# EAGLE design AD2 Breadboard Breakout v0.1 (EAGLE 9.6.2)
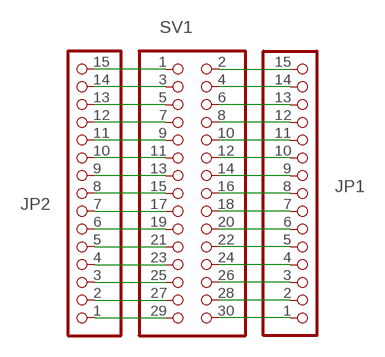
[diagram p0: schematic, sheet 1]

## Parts
JP1  PINHD-1X15-CB  [1X15-CB]
JP2  PINHD-1X15-CB  [1X15-CB]
SV1  PINHD-2X15  [2X15]

## Nets
N$1: JP2.15 SV1.1
N$2: JP1.15 SV1.2
N$3: JP2.14 SV1.3
N$4: JP1.14 SV1.4
N$5: JP2.13 SV1.5
N$6: JP1.13 SV1.6
N$7: JP2.12 SV1.7
N$8: JP1.12 SV1.8
N$9: JP2.11 SV1.9
N$10: JP1.11 SV1.10
N$11: JP2.10 SV1.11
N$12: JP1.10 SV1.12
N$13: JP2.9 SV1.13
N$14: JP1.9 SV1.14
N$15: JP2.8 SV1.15
N$16: JP1.8 SV1.16
N$17: JP2.7 SV1.17
N$18: JP1.7 SV1.18
N$19: JP2.6 SV1.19
N$20: JP1.6 SV1.20
N$21: JP2.5 SV1.21
N$22: JP1.5 SV1.22
N$23: JP2.4 SV1.23
N$24: JP1.4 SV1.24
N$25: JP2.3 SV1.25
N$26: JP1.3 SV1.26
N$27: JP2.2 SV1.27
N$28: JP1.2 SV1.28
N$29: JP2.1 SV1.29
N$30: JP1.1 SV1.30

## Library data of the parts
JP1 JP2 = Adafruit3.0:PINHD-1X15: PIN HEADER
SV1 = pinhead:PINHD-2X15: PIN HEADER

## Board
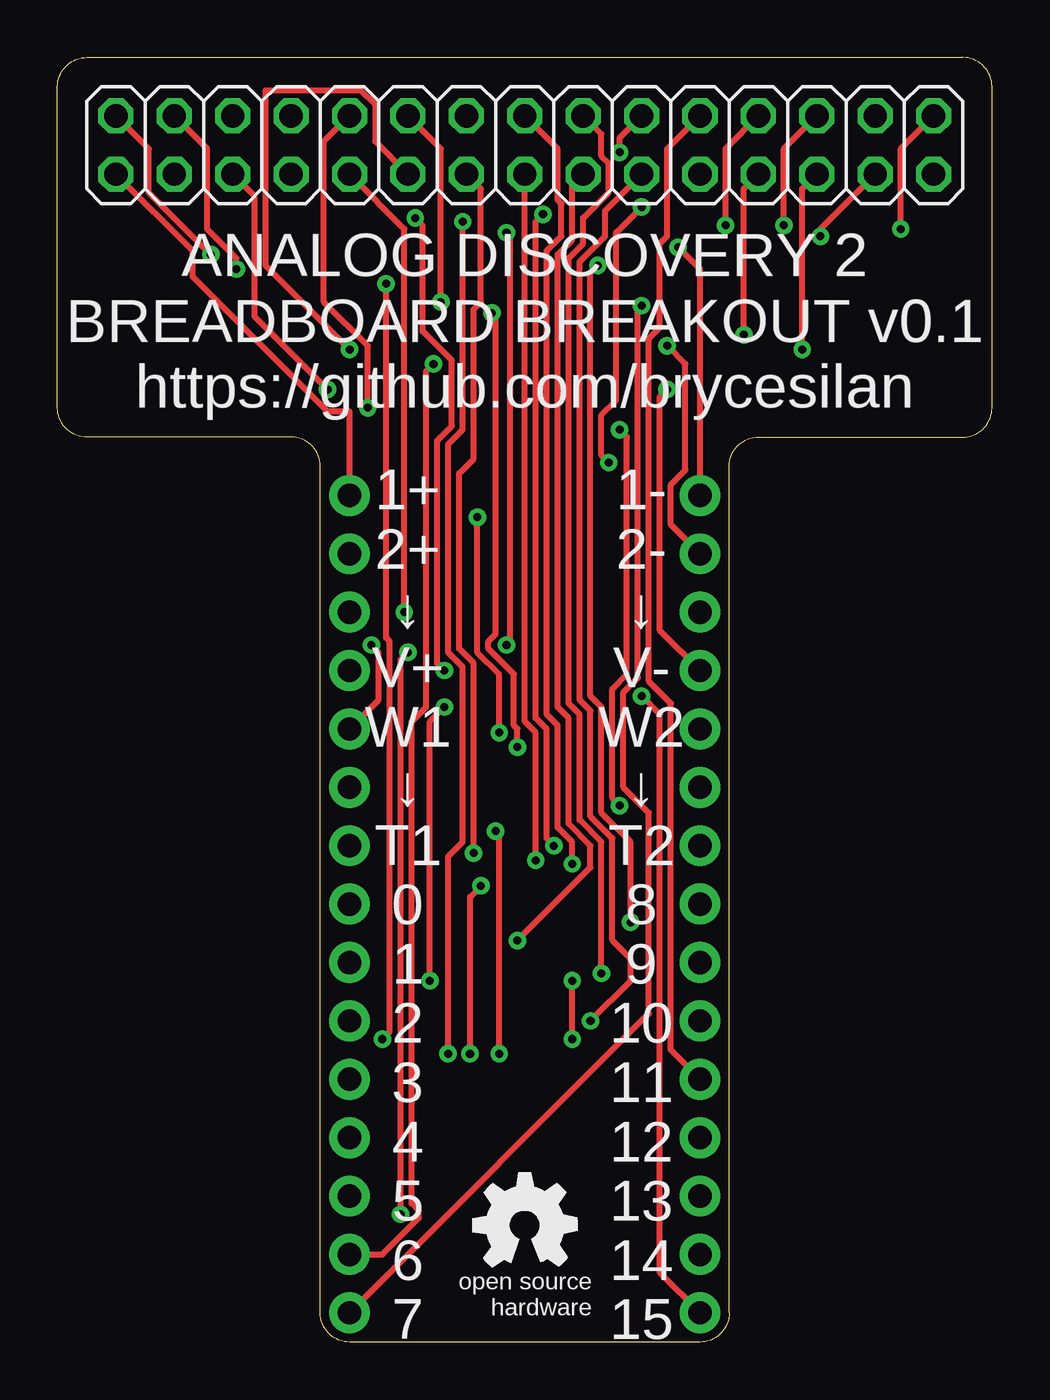
[diagram p1: board, top side]
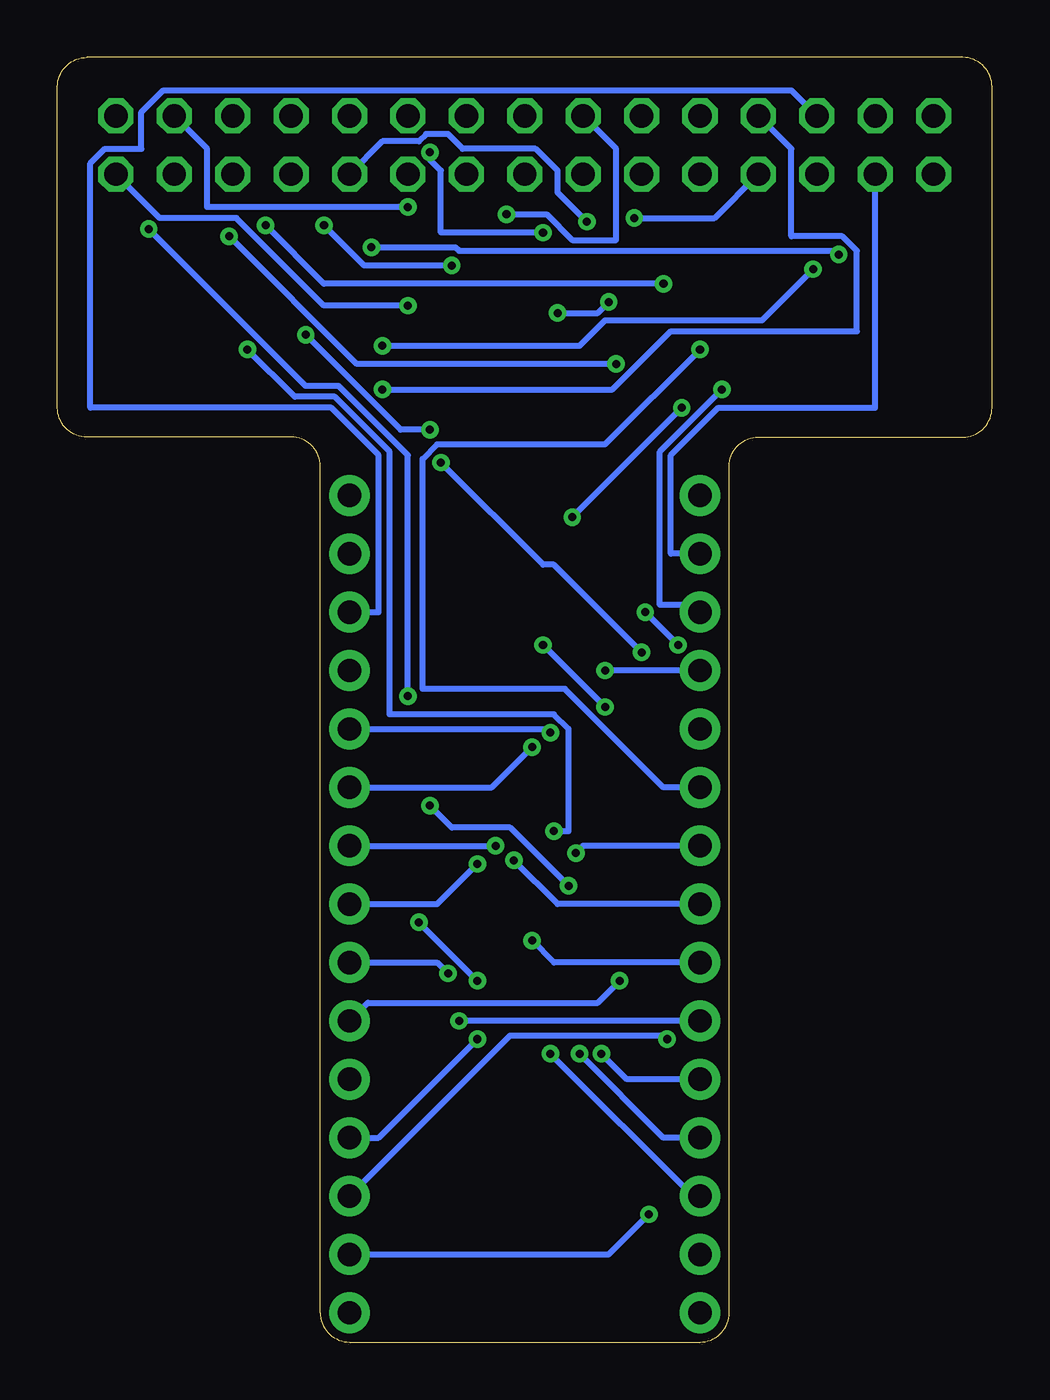
[diagram p2: board, bottom side, seen from below]

Size 40.64 x 55.88 mm. Coordinates in mm from the lower left corner, seen from the top.
Outline: 29.21,1.27 29.21,38.1 arc-90 30.48,39.37 39.37,39.37 arc90 40.64,40.64 40.64,54.61 arc90 39.37,55.88 1.27,55.88 arc90 0,54.61 0,40.64 arc90 1.27,39.37 10.16,39.37 arc-90 11.43,38.1 11.43,1.27 arc90 12.7,0 27.94,0 arc90 29.21,1.27
Copper layers (1*16): Top 0.035mm / dielectric 1.5mm / Bottom 0.035mm
Design rules "default *": minimum track width 10mil, minimum drill 0.35mm, track to track 6mil, track to pad 6mil, pad to pad 6mil, via to via 6mil, smd to smd 6mil, copper to edge 40mil, drill to drill 2mil, minimum pad ring 10mil, minimum via ring 8mil, stop-mask expansion 4mil, vias tented up to drill 0mil, thermal gap 10mil

### Footprints (pad centres in the part's own frame; a part is rotated, then mirrored left to right if it is on the bottom)
1X15-CB = drill 1.016 pad 1.778: 1 -17.78,0; 2 -15.24,0; 3 -12.7,0; 4 -10.16,0; 5 -7.62,0; 6 -5.08,0; 7 -2.54,0; 8 0,0; 9 2.54,0; 10 5.08,0; 11 7.62,0; 12 10.16,0; 13 12.7,0; 14 15.24,0; 15 17.78,0
2X15 = drill 1.016 octagon: 1 -17.78,-1.27; 2 -17.78,1.27; 3 -15.24,-1.27; 4 -15.24,1.27; 5 -12.7,-1.27; 6 -12.7,1.27; 7 -10.16,-1.27; 8 -10.16,1.27; 9 -7.62,-1.27; 10 -7.62,1.27; 11 -5.08,-1.27; 12 -5.08,1.27; 13 -2.54,-1.27; 14 -2.54,1.27; 15 0,-1.27; 16 0,1.27; 17 2.54,-1.27; 18 2.54,1.27; 19 5.08,-1.27; 20 5.08,1.27; 21 7.62,-1.27; 22 7.62,1.27; 23 10.16,-1.27; 24 10.16,1.27; 25 12.7,-1.27; 26 12.7,1.27; 27 15.24,-1.27; 28 15.24,1.27; 29 17.78,-1.27; 30 17.78,1.27

### Placement (x,y rotation side)
JP1  27.94,19.05 90 top
JP2  12.7,19.05 90 top
SV1  20.32,52.07 0 top
U$1  [OSHW_5MM]  20.32,5.08 0 top

### Tracks (layer width: path | path; a pad name or v marks a point on that pad's centre or on a via)
N$1
  Top 0.254: SV1.1 5.87,47.47 5.87,46.36 11.75,40.48 12.7,40.48 JP2.15
N$2  (via drill 0.35)
  Top 0.254: SV1.2 3.97,51.91 3.97,50.01 v6.67,47.31 | v26.99,47.62 27.94,46.67 JP1.15
  Bottom 0.254: v6.67,47.31 6.83,47.47 23.18,47.47 23.34,47.62 v26.99,47.62
N$3
  Bottom 0.254: SV1.3 5.08,40.64 11.91,40.64 13.97,38.58 13.97,34.29 JP2.14
N$4  (via drill 0.35)
  Top 0.254: SV1.4 6.51,51.91 6.51,48.42 7.78,47.15 v7.78,46.67 | v26.51,43.34 27.3,42.55 27.3,37.94 26.67,37.31 26.67,35.56 JP1.14
  Bottom 0.254: v7.78,46.67 10,44.45 16.83,44.45 17.94,43.34 v26.51,43.34
N$5  (via drill 0.35)
  Top 0.254: SV1.5 8.57,49.85 8.57,44.61 v11.75,41.43
  Bottom 0.254: v11.75,41.43 14.45,38.73 14.45,32.07 13.02,32.07 JP2.13
N$6
  Bottom 0.254: SV1.6 8.73,54.45 36.04,54.45 36.99,53.5 36.99,51.91 38.58,51.91 39.21,51.28 39.21,40.64 28.73,40.64 26.67,38.58 26.67,31.75 JP1.13
N$7  (via drill 0.35)
  Top 0.254: v15.56,48.89 15.88,48.58 15.88,43.97 17.15,42.7 17.15,39.85 16.51,39.21 16.51,29.53 v16.83,29.21
  Bottom 0.254: SV1.7 12.06,48.89 v15.56,48.89 | JP2.12 v16.83,29.21
N$8  (via drill 0.35)
  Top 0.254: v26.51,41.43 26.19,41.12 26.19,30.96 JP1.12
  Bottom 0.254: SV1.8 8.73,51.91 8.73,48.1 6.51,48.1 5.87,47.47 5.87,43.97 13.97,43.97 16.51,41.43 v26.51,41.43
N$9  (via drill 0.35)
  Top 0.254: SV1.9 15.08,48.42 v15.08,31.75 | v13.65,30.32 13.97,30 13.97,27.94 JP2.11
  Bottom 0.254: v13.65,30.32 v15.08,31.75
N$10  (via drill 0.35)
  Top 0.254: SV1.10 11.59,52.23 11.59,45.24 13.49,43.34 v13.49,40.64 | v18.26,35.88 18.26,30 19.21,29.05 v19.21,26.51
  Bottom 0.254: v18.26,35.88 v13.49,40.64 | v19.21,26.51 19.37,26.67 JP1.11
N$11  (via drill 0.35)
  Top 0.254: SV1.11 13.81,52.23 13.81,53.82 13.18,54.45 9.05,54.45 9.05,46.83 v12.7,43.18
  Bottom 0.254: v12.7,43.18 16.83,39.05 24.13,39.05 24.77,38.42 24.77,28.42 18.57,28.42 14.29,24.13 JP2.10
N$12  (via drill 0.35)
  Top 0.254: SV1.12 16.67,51.91 v16.67,45.24 | v18.89,44.77 19.05,44.61 19.05,30.8 18.73,30.48 18.73,30.16 19.84,29.05 19.84,26.83 20,26.67 v20,25.88
  Bottom 0.254: v16.67,45.24 17.15,44.77 v18.89,44.77 | v20,25.88 21.75,24.13 JP1.10
N$13  (via drill 0.35)
  Top 0.254: SV1.13 18.41,50.16 18.41,45.24 18.1,44.93 18.1,38.42 17.46,37.78 17.46,30.16 18.1,29.53 v18.1,21.27
  Bottom 0.254: v18.1,21.27 17.78,21.59 JP2.9
N$14  (via drill 0.35)
  Top 0.254: v21.11,49.05 20.8,48.74 20.8,27.15 21.27,26.67 21.27,21.91 v21.59,21.59
  Bottom 0.254: SV1.14 16.35,51.91 16.35,47.94 18.26,47.94 19.37,49.05 v21.11,49.05 | JP1.9 v21.59,21.59
N$15  (via drill 0.35)
  Top 0.254: SV1.15 20.32,26.99 20.8,26.51 v20.8,20.95
  Bottom 0.254: v20.8,20.95 18.89,19.05 JP2.8
N$16  (via drill 0.35)
  Top 0.254: SV1.16 21.75,51.91 21.75,49.69 21.91,49.53 21.91,48.1 21.27,47.47 21.27,27.3 21.75,26.83 21.75,22.38 22.38,21.75 v22.38,20.8
  Bottom 0.254: v22.38,20.8 24.13,19.05 JP1.8
N$17  (via drill 0.35)
  Top 0.254: SV1.17 22.38,50.32 22.38,47.94 21.75,47.31 21.75,27.62 22.23,27.15 22.23,22.54 23.18,21.59 23.18,20.64 v20,17.46
  Bottom 0.254: v20,17.46 19.05,16.51 JP2.7
N$18  (via drill 0.35)
  Top 0.254: SV1.18 23.65,52.55 23.65,51.59 23.97,51.28 23.97,50.01 22.86,48.89 22.86,47.78 22.23,47.15 22.23,27.78 22.7,27.3 22.7,22.7 23.65,21.75 v23.65,16.03
  Bottom 0.254: v23.65,16.03 24.13,16.51 JP1.7
N$19  (via drill 0.35)
  Top 0.254: SV1.19 23.81,49.21 23.81,48.1 22.7,46.99 22.7,27.94 23.18,27.46 23.18,22.86 24.13,21.91 24.13,17.46 24.92,16.67 24.92,15.72 v23.18,13.97
  Bottom 0.254: JP2.6 v23.18,13.97
N$20  (via drill 0.35)
  Top 0.254: SV1.20 24.45,52.39 v24.45,51.75 | v19.53,48.26 19.69,48.1 19.69,30.48 v19.53,30.32 | v16.83,27.62 16.19,26.99 v16.19,15.72
  Bottom 0.254: v24.45,51.75 24.45,51.44 23.97,50.96 23.97,48.26 v19.53,48.26 | v16.83,27.62 v19.53,30.32 | v16.19,15.72 17.15,14.76 27.15,14.76 JP1.6
N$21  (via drill 0.35)
  Top 0.254: v17.62,48.74 17.62,39.69 16.99,39.05 16.99,30 17.62,29.37 17.62,21.75 16.99,21.11 v16.99,12.54
  Bottom 0.254: SV1.21 26.51,52.23 24.92,52.23 24.61,52.55 23.65,52.55 23.02,51.91 19.84,51.91 18.89,50.96 18.89,50.01 v17.62,48.74 | v16.99,12.54 15.88,11.43 JP2.5
N$22
  Top 0.254: SV1.22 26.51,51.91 26.51,48.1 26.19,47.78 26.19,44.13 25.72,43.66 25.72,28.73 26.67,27.78 26.67,12.7 JP1.5
N$23  (via drill 0.35)
  Top 0.254: SV1.23 29.84,50.16 v29.84,43.81 | v24.45,39.69 24.77,39.37 24.77,29.05 24.13,28.42 24.13,23.65 v24.45,23.34 | v18.41,19.84 17.94,19.37 v17.94,12.54
  Bottom 0.254: v29.84,43.81 25.72,39.69 v24.45,39.69 | v24.45,23.34 23.49,22.38 20.95,22.38 v18.41,19.84 | v17.94,12.54 14.29,8.89 JP2.4
N$24  (via drill 0.35)
  Top 0.254: SV1.24 29.05,51.91 v29.05,48.58 | v23.49,46.83 23.18,46.51 23.18,28.1 23.65,27.62 23.65,23.02 24.92,21.75 v24.92,18.26 | v22.38,13.18 v22.38,15.72
  Bottom 0.254: v29.05,48.58 27.3,46.83 v23.49,46.83 | v22.38,15.72 v24.92,18.26 | v22.38,13.18 26.67,8.89 JP1.4
N$25  (via drill 0.35)
  Top 0.254: SV1.25 32.38,50.16 v32.38,43.18 | v19.05,22.22 19.21,22.07 v19.21,12.54
  Bottom 0.254: v32.38,43.18 30.32,41.12 28.58,41.12 26.19,38.73 26.19,27.3 19.05,27.3 18.41,26.67 18.41,22.22 v19.05,22.22 | v19.21,12.54 13.02,6.35 JP2.3
N$26  (via drill 0.35)
  Top 0.254: SV1.26 31.59,51.91 v31.59,48.58 | v14.29,46.04 14.29,30.64 14.45,30.48 14.45,13.49 v14.13,13.18
  Bottom 0.254: v31.59,48.58 29.05,46.04 v14.29,46.04 | v14.13,13.18 14.29,13.34 20.95,13.34 JP1.3
N$27  (via drill 0.35)
  Top 0.254: SV1.27 33.18,48.42 v33.18,48.1 | v16.35,42.55 16.03,42.23 16.03,27.62 15.4,26.99 15.4,6.03 15.72,5.71 15.72,5.4 14.13,3.81 JP2.2
  Bottom 0.254: v33.18,48.1 27.62,42.55 v16.35,42.55
N$28  (via drill 0.35)
  Top 0.254: v25.4,49.37 24.29,48.26 24.29,40.96 23.65,40.32 23.65,38.58 v23.97,38.26 | v15.24,30 14.92,29.69 v14.92,5.56
  Bottom 0.254: SV1.28 34.13,51.91 34.13,49.37 v25.4,49.37 | v23.97,38.26 19.53,33.81 19.05,33.81 v15.24,30 | v14.92,5.56 16.67,3.81 JP1.2
N$29  (via drill 0.35)
  Top 0.254: v25.4,45.08 25.24,44.93 25.24,28.89 24.61,28.26 24.61,24.13 25.72,23.02 25.72,14.29 JP2.1
  Bottom 0.254: SV1.29 36.2,48.89 32.86,48.89 29.05,45.08 v25.4,45.08
N$30  (via drill 0.35)
  Top 0.254: SV1.30 36.67,51.91 v36.67,48.42 | v25.4,28.1 26.19,27.3 26.19,3.02 JP1.1
  Bottom 0.254: v36.67,48.42 29.84,41.59 28.42,41.59 25.4,38.58 v25.4,28.1

### Text on the board
tNames: ANALOG DISCOVERY 2 / BREADBOARD BREAKOUT v0.1 / https://github.com/brycesilan | 1+ / 2+ / ↓ / V+ / W1 / ↓ / T1 / 0 / 1 / 2 / 3 / 4 / 5 / 6 / 7 | 1- / 2- / ↓ / V- / W2 / ↓ / T2 / 8 / 9 / 10 / 11 / 12 / 13 / 14 / 15